# EAGLE schematic arduinoven (EAGLE 5.11)
REVISION: 1.0RC3
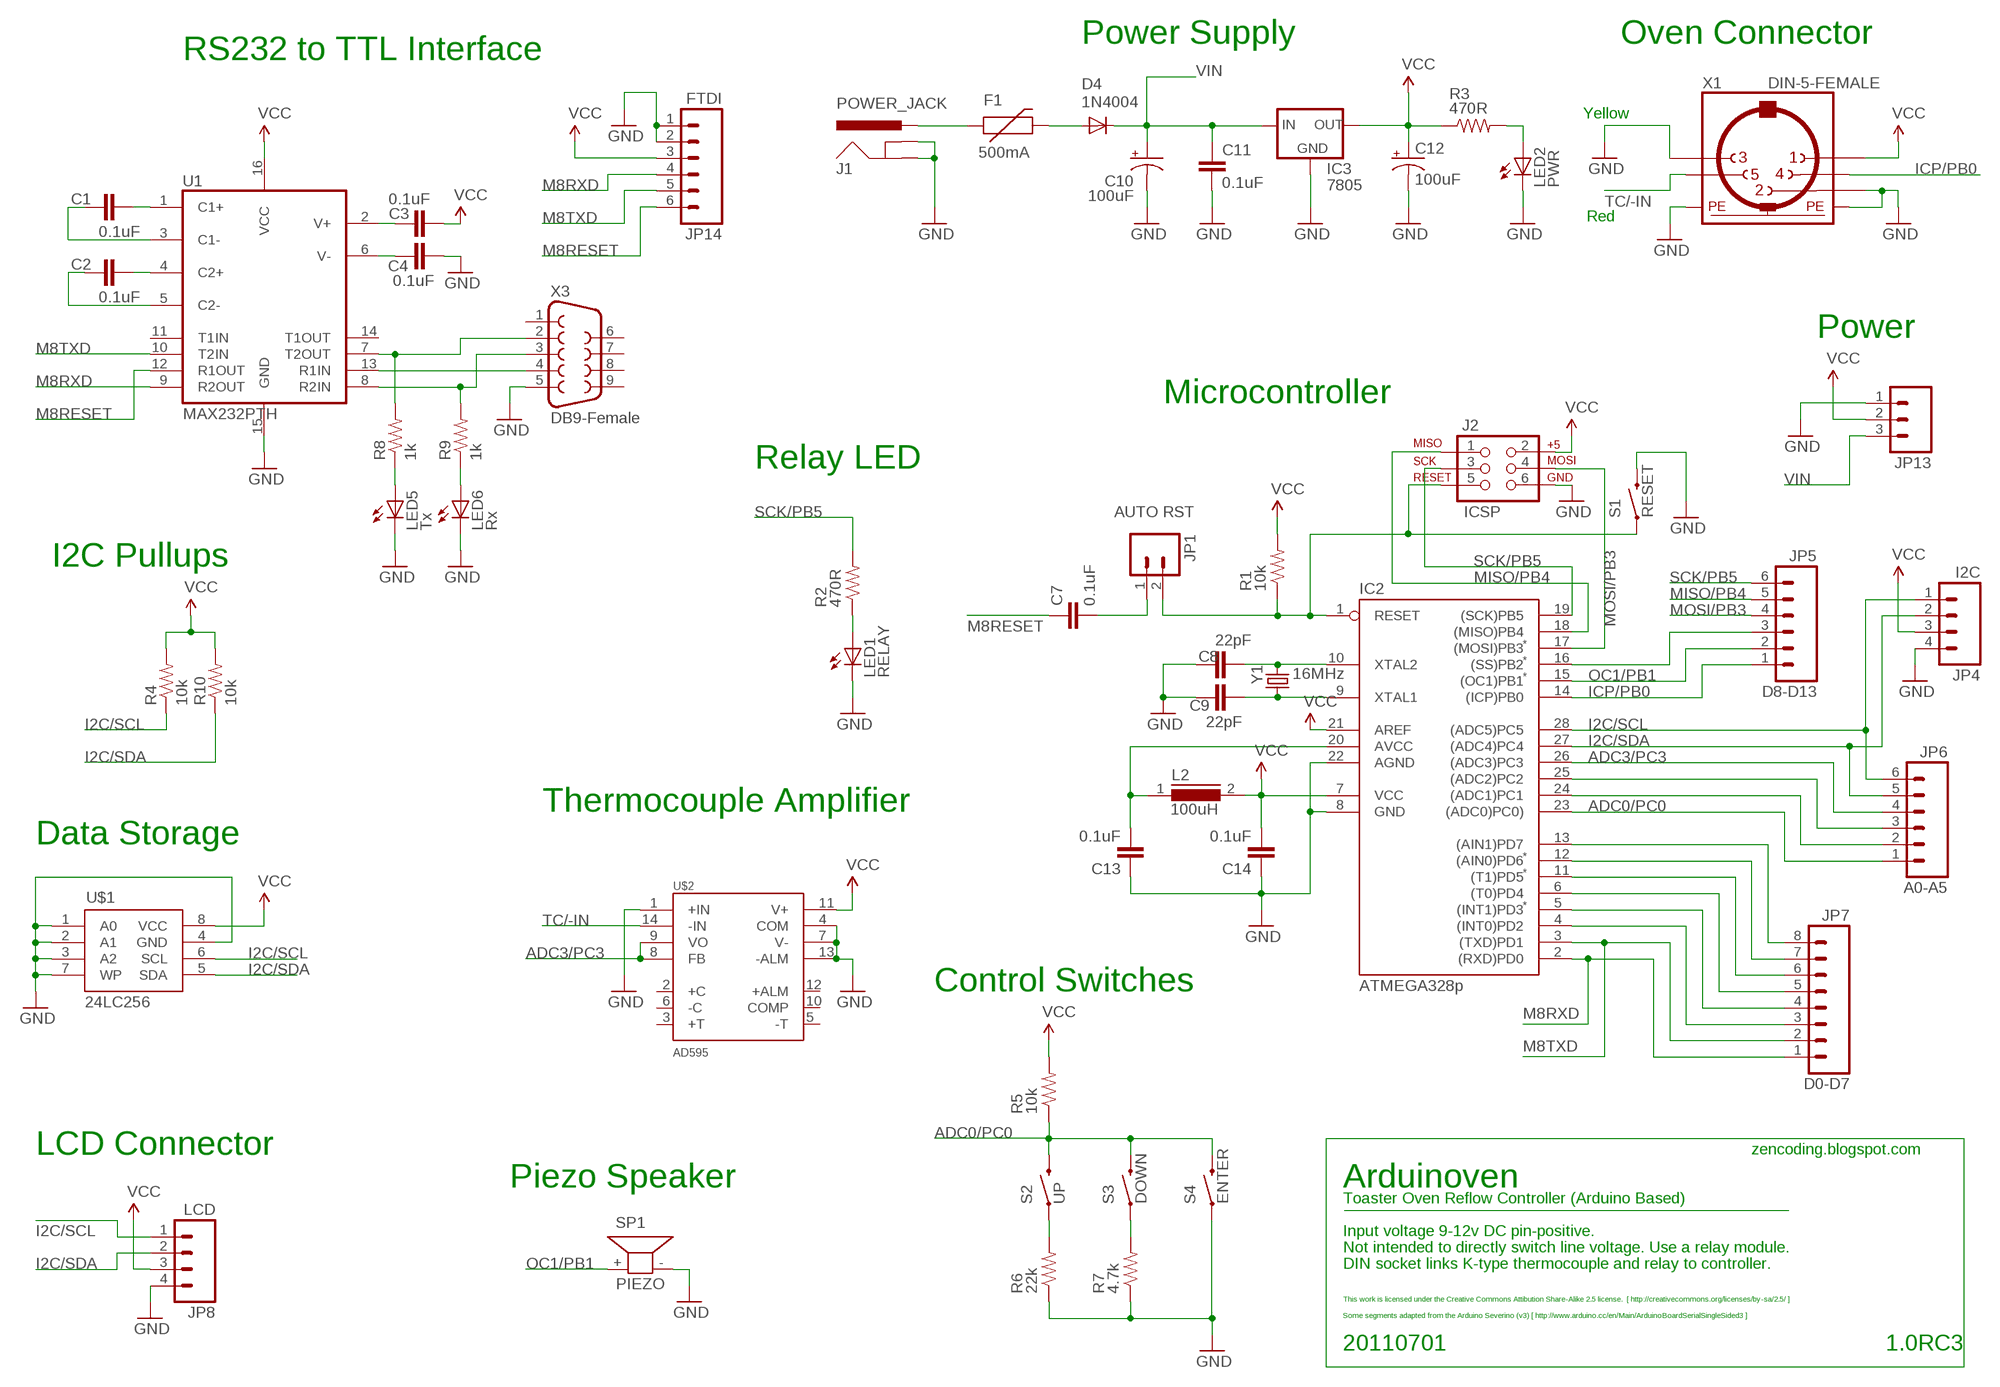
[diagram p0: schematic, sheet 1]

## Parts
C1  0.1uF  CAPPTH  [CAP-PTH-SMALL]
C2  0.1uF  CAPPTH  [CAP-PTH-SMALL]
C3  0.1uF  CAPPTH  [CAP-PTH-SMALL]
C4  0.1uF  CAPPTH  [CAP-PTH-SMALL]
C7  0.1uF  CAPPTH2  [CAP-PTH-SMALL2]
C8  22pF  CAPPTH2  [CAP-PTH-SMALL2]
C9  22pF  CAPPTH2  [CAP-PTH-SMALL2]
C10  100uF  CAP_POLPTH1  [CPOL-RADIAL-100UF-25V]
C11  0.1uF  CAPPTH2  [CAP-PTH-SMALL2]
C12  100uF  CAP_POLPTH1  [CPOL-RADIAL-100UF-25V]
C13  0.1uF  CAPPTH2  [CAP-PTH-SMALL2]
C14  0.1uF  CAPPTH2  [CAP-PTH-SMALL2]
D4  1N4004  DIODEPTH  [DIODE-1N4001]
F1  500mA  PTCPTH  [PTC]
IC2  ATMEGA328p  ATMEGA328P  [DIL28-3]
IC3  7805  V_REG_78XX-TO-220  [TO-220-ALT]
J1  POWER_JACK  POWER_JACKPTH_LOCK  [POWER_JACK_PTH_LOCK]
J2  ICSP  ICSP_HEADER2X3_LOCK  [2X3_LOCK]
JP1  AUTO RST  M02PTH  [1X02]
JP4  I2C  M04LOCK  [1X04_LOCK]
JP5  D8-D13  M06LOCK  [1X06_LOCK]
JP6  A0-A5  M06LOCK  [1X06_LOCK]
JP7  D0-D7  M08LOCK  [1X08_LOCK]
JP8  LCD  M04LOCK  [1X04_LOCK]
JP13  M03LOCK  [1X03_LOCK]
JP14  FTDI  M06LOCK  [1X06_LOCK]
L2  100uH  82114R  [82114R]
LED1  RELAY  LED5MM  [LED5MM]
LED2  PWR  LED5MM  [LED5MM]
LED5  Tx  LED3MM  [LED3MM]
LED6  Rx  LED3MM  [LED3MM]
R1  10k  RESISTORPTH-1/4W  [AXIAL-0.4]
R2  470R  RESISTORPTH-1/4W  [AXIAL-0.4]
R3  470R  RESISTORPTH-1/4W  [AXIAL-0.4]
R4  10k  RESISTORAXIAL-0.3  [AXIAL-0.3]
R5  10k  RESISTORPTH-1/4W  [AXIAL-0.4]
R6  22k  RESISTORPTH-1/4W  [AXIAL-0.4]
R7  4.7k  RESISTORPTH-1/4W  [AXIAL-0.4]
R8  1k  RESISTORPTH-1/4W  [AXIAL-0.4]
R9  1k  RESISTORPTH-1/4W  [AXIAL-0.4]
R10  10k  RESISTORAXIAL-0.3  [AXIAL-0.3]
S1  RESET  SWITCH-MOMENTARY-2PTH  [TACTILE-PTH]
S2  UP  SWITCH-MOMENTARY-2PTH  [TACTILE-PTH]
S3  DOWN  SWITCH-MOMENTARY-2PTH  [TACTILE-PTH]
S4  ENTER  SWITCH-MOMENTARY-2PTH  [TACTILE-PTH]
SP1  PIEZO  KSS1201  [KSS1201]
U1  MAX232PTH  [DIL16]
U$1  24LC256  [DIL08]
U$2  AD595  [DIL14]
X1  DIN-5-FEMALE  [DIN-5-PTH]
X3  DB9-Female  DB9FEMALE  [DB9]
Y1  16MHz  CRYSTALHC49US  [HC49US]

## Nets
ADC0/PC0: IC2.23((ADC0)PC0)) JP6.1 R5.P$1 S2.3 S3.3 S4.3
ADC1/PC1: IC2.24((ADC1)PC1) JP6.2
ADC2/PC2: IC2.25((ADC2)PC2) JP6.3
ADC3/PC3: IC2.26((ADC3)PC3) JP6.4 U$2.8(FB) U$2.9(VO)
AIN0/PD6: IC2.12((AIN0)PD6) JP7.7
AIN1/PD7: IC2.13((AIN1)PD7) JP7.8
GND: C4.2 C8.1 C9.2 C10.2(-) C11.2 C12.2(-) C13.1 C14.1 IC2.8(GND) IC2.22(AGND) IC3.GND J1.GND J1.GNDBREAK J2.6 JP4.4 JP8.4 JP13.1 JP14.1 JP14.2 LED1.K(C) LED2.K(C) LED5.K(C) LED6.K(C) R6.P$1 R7.P$1 S1.3 S4.1 SP1.- U1.15(GND) U$1.1(A0) U$1.2(A1) U$1.3(A2) U$1.4(GND) U$1.7(WP) U$2.1(+IN) U$2.4(COM) U$2.7(V-) U$2.13(-ALM) X1.2 X1.3 X1.PE X1.PE@(PE) X3.5
I2C/SCL: IC2.28((ADC5)PC5) JP4.1 JP6.6 JP8.1 R4.P$1 U$1.6(SCL)
I2C/SDA: IC2.27((ADC4)PC4) JP4.2 JP6.5 JP8.2 R10.P$1 U$1.5(SDA)
ICP/PB0: IC2.14((ICP)PB0) JP5.1 X1.4
INT0/PD2: IC2.4((INT0)PD2) JP7.3
INT1/PD3: IC2.5((INT1)PD3) JP7.4
M8RESET: C7.1 JP14.6 U1.12(R1OUT)
M8RXD: IC2.2((RXD)PD0) JP7.1 JP14.4 U1.9(R2OUT)
M8TXD: IC2.3((TXD)PD1) JP7.2 JP14.5 U1.10(T2IN)
MISO/PB4: IC2.18((MISO)PB4) J2.1 JP5.5
MOSI/PB3: IC2.17((MOSI)PB3) J2.4 JP5.4
N$1: LED1.A R2.P$1
N$2: IC2.1(RESET) J2.5 JP1.2 R1.P$1 S1.1
N$5: LED2.A R3.P$2
N$6: R6.P$2 S2.1
N$7: R7.P$2 S3.1
N$9: F1.P$1 J1.PWR
N$10: D4.A F1.P$2
N$11: C1.2 U1.1(C1+)
N$19: C7.2 JP1.1
N$20: C8.2 IC2.10(XTAL2) Y1.2
N$21: C9.1 IC2.9(XTAL1) Y1.1
N$23: C13.2 IC2.20(AVCC) L2.1
N$24: C1.1 U1.3(C1-)
N$25: C2.2 U1.4(C2+)
N$26: C2.1 U1.5(C2-)
N$27: C4.1 U1.6(V-)
N$28: C3.2 U1.2(V+)
N$29: U1.13(R1IN) X3.4
N$30: R9.P$2 U1.8(R2IN) X3.3
N$31: R8.P$2 U1.7(T2OUT) X3.2
N$32: LED5.A R8.P$1
N$33: LED6.A R9.P$1
OC1/PB1: IC2.15((OC1)PB1) JP5.2 SP1.+
SCK/PB5: IC2.19((SCK)PB5) J2.3 JP5.6 R2.P$2
SS/PB2: IC2.16((SS)PB2) JP5.3
T0/PD4: IC2.6((T0)PD4) JP7.5
T1/PD5: IC2.11((T1)PD5) JP7.6
TC/-IN: U$2.14(-IN) X1.5
VCC: C3.1 C12.1(+) C14.2 IC2.7(VCC) IC2.21(AREF) IC3.OUT J2.2 JP4.3 JP8.3 JP13.2 JP14.3 L2.2 R1.P$2 R3.P$1 R4.P$2 R5.P$2 R10.P$2 U1.16(VCC) U$1.8(VCC) U$2.11(V+) X1.1
VIN: C10.1(+) C11.1 D4.C IC3.IN JP13.3
Unconnected: U1.11(T1IN) U1.14(T1OUT) U$2.2(+C) U$2.3(+T) U$2.5(-T) U$2.6(-C) U$2.10(COMP) U$2.12(+ALM) X3.1 X3.6 X3.7 X3.8 X3.9

## Notes on the sheet
- Power Supply | Oven Connector
- RS232 to TTL Interface
- Yellow
- Red
- Power
- Microcontroller
- Relay LED
- I2C Pullups
- Thermocouple Amplifier
- Data Storage
- Control Switches
- LCD Connector | zencoding.blogspot.com
- Piezo Speaker | Arduinoven
- Toaster Oven Reflow Controller (Arduino Based)
- Input voltage 9-12v DC pin-positive.
- Not intended to directly switch line voltage. Use a relay module.
- DIN socket links K-type thermocouple and relay to controller.
- This work is licensed under the Creative Commons Attibution Share-Alike 2.5 license.  [ http://creativecommons.org/licenses/by-sa/2.5/ ]
- Some segments adapted from the Arduino Severino (v3) [ http://www.arduino.cc/en/Main/ArduinoBoardSerialSingleSided3 ]
- 20110701

## Library data of the parts
C1-C4 C7-C9 C11 C13 C14 = SparkFun:CAP: Capacitor Standard 0603 ceramic capacitor, and 0.1" leaded capacitor.
C10 C12 = SparkFun:CAP_POL: Capacitor Polarized These are standard SMD and PTH capacitors. Normally 10uF, 47uF, and 100uF in electrolytic and tantalum varieties. Always verify the external diameter of the through hole cap, it varies with capacity, voltage, and manufacturer. The EIA devices should be standard.
D4 = SparkFun:DIODE: Diode These are standard reverse protection diodes and small signal diodes. SMA package can handle up to about 1A. SOD-323 can handle about 200mA. What the SOD-323 package when ordering, there are some mfgs out there that are 5-pin packages.
F1 = SparkFun:PTC: Resettable Fuse PTC Resettable Fuse. Spark Fun Electronics SKU : COM-08357
IC2 = zencoding:ATMEGA328P: ATMEGA328p MICROCONTROLLER 32 Kbytes FLASH 2 Kbytes SRAM 1 Kbytes EEPROM UART 6-channel 10 bit ADC 14 digital I/O pins (6 provide PWM) PWM pins marked with (*)
IC3 = SparkFun:V_REG_78XX: Voltage Regulator Standard 7805 5V regulator. IGO (Input Ground Output). Spark Fun Electronics SKU : COM-00107
J1 = SparkFun:POWER_JACK: Power Jack This is the standard 5.5mm barrel jack for power. The PTH is the most common, proven, reliable, footprint. All others are experimental. The Slot footprint only works if the mill layer is transmitted to the PCB fab house so be warned. Spark Fun Electronics SKU : PRT-00119. Mating wall wart : TOL-00298 (and others)
J2 = zencoding:ICSP_HEADER: AVR ISP 6 Pin This is the reduced ISP connector for AVR programming. Common on Arduino. This footprint will take up less PCB space and can be used with a 10-pin to 6-pin adapter such as SKU: BOB-08508
JP1 = SparkFun:M02: Header 2 Standard 2-pin 0.1" header. Use with straight break away headers (SKU : PRT-00116), right angle break away headers (PRT-00553), swiss pins (PRT-00743), machine pins (PRT-00117), and female headers (PRT-00115). Molex polarized connector foot print use with SKU : PRT-08233 with associated crimp pins and housings.
JP4 JP8 = SparkFun:M04: Header 4 Standard 4-pin 0.1" header. Use with straight break away headers (SKU : PRT-00116), right angle break away headers (PRT-00553), swiss pins (PRT-00743), machine pins (PRT-00117), and female headers (PRT-00115). Molex polarized connector foot print use with SKU : PRT-08231 with associated crimp pins and housings. 1MM SMD Version SKU: PRT-10208
JP5 JP6 JP14 = SparkFun:M06: Header 6 Standard 6-pin 0.1" header. Use with straight break away headers (SKU : PRT-00116), right angle break away headers (PRT-00553), swiss pins (PRT-00743), machine pins (PRT-00117), and female headers (PRT-00115). Molex polarized connector foot print use with SKU : PRT-08094 with associated crimp pins and housings. NOTES ON THE VARIANTS LOCK and LOCK_LONGPADS... This footprint was designed to help hold the alignment of a through-hole component (i.e. 6-pin header) while soldering it into place. You may notice that each hole has been shifted either up or down by 0.005 of an inch from it's more standard position (which is a perfectly straight line). This slight alteration caused the pins (the squares in the middle) to touch the edges of the holes. Because they are alternating, it causes a "brace" to hold the component in place. 0.005 has proven to be the perfect amount of "off-center" position when using our standard breakaway headers. Although looks a little odd when you look at the bare footprint, once you have a header in there, the alteration is very hard to notice. Also, if you push a header all the way into place, it is covered up entirely on the bottom side. This idea of altering the position of holes to aid alignment will be further integrated into the Sparkfun Library for other footprints. It can help hold any component with 3 or more connection pins.
JP7 = SparkFun:M08: Header 8 Standard 8-pin 0.1" header. Use with straight break away headers (SKU : PRT-00116), right angle break away headers (PRT-00553), swiss pins (PRT-00743), machine pins (PRT-00117), and female headers (PRT-00115).
JP13 = SparkFun:M03: Header 3 Standard 3-pin 0.1" header. Use with straight break away headers (SKU : PRT-00116), right angle break away headers (PRT-00553), swiss pins (PRT-00743), machine pins (PRT-00117), and female headers (PRT-00115). Molex polarized connector foot print use with SKU : PRT-08232 with associated crimp pins and housings.
L2 = zencoding:82114R: INDUCTOR
LED1 LED2 LED5 LED6 = SparkFun:LED: LEDs Standard schematic elements and footprints for 5mm, 3mm, 1206, and 0603 sized LEDs. 5mm - Spark Fun Electronics SKU : COM-00529 (and others)
R1-R10 = SparkFun:RESISTOR: Resistor Basic schematic elements and footprints for 0603, 1206, and PTH resistors.
S1-S4 = SparkFun:SWITCH-MOMENTARY-2
SP1 = buzzer:KSS1201: SPEAKER Source: Schukat; OC_FARNELL: unknown; OC_NEWARK: unknown
U1 = SparkFun:MAX232: RS232 Transceiver Very common IC. This is generically called 'MAX232', but works with the 3V equivalent MAX3232 generic ICs. Field tested and mother approved. Spark Fun Electronics SKU : COM-00316 (DIP) and COM-00589 (SMD)
U$1 = zencoding:24LC256: 24LC256 I2C EEPROM (256kbit). Sparkfun Part number: COM-00525
U$2 = zencoding:AD595: AD595 Thermocouple Amplifier Sparkfun Part: COM-00306
X1 = zencoding:DIN-5-FEMALE: Female DIN-5 90-degree PCB Through-Hole 5 pins 90 deg. with shield, horizontal (DIN 41524) Compatible with Sparkfun Part: PRT-09536 Compatible with Jaycar Part: PS0350; JAYCAR: PS0350; SPARKFUN: PRT-09536
X3 = SparkFun:DB9: DB9 Connector Standard DB9 (D-Sub 9) serial connector. Can be used for CAN bus as well as RS485 and RS232. Footprint production proven. Spark Fun Electronics SKU : PRT-00429
Y1 = SparkFun:CRYSTAL: Crystals Various standard crystals. Proven footprints. Spark Fun Electronics SKU : COM-00534

## Net classes
1 power: width 0.61 mm